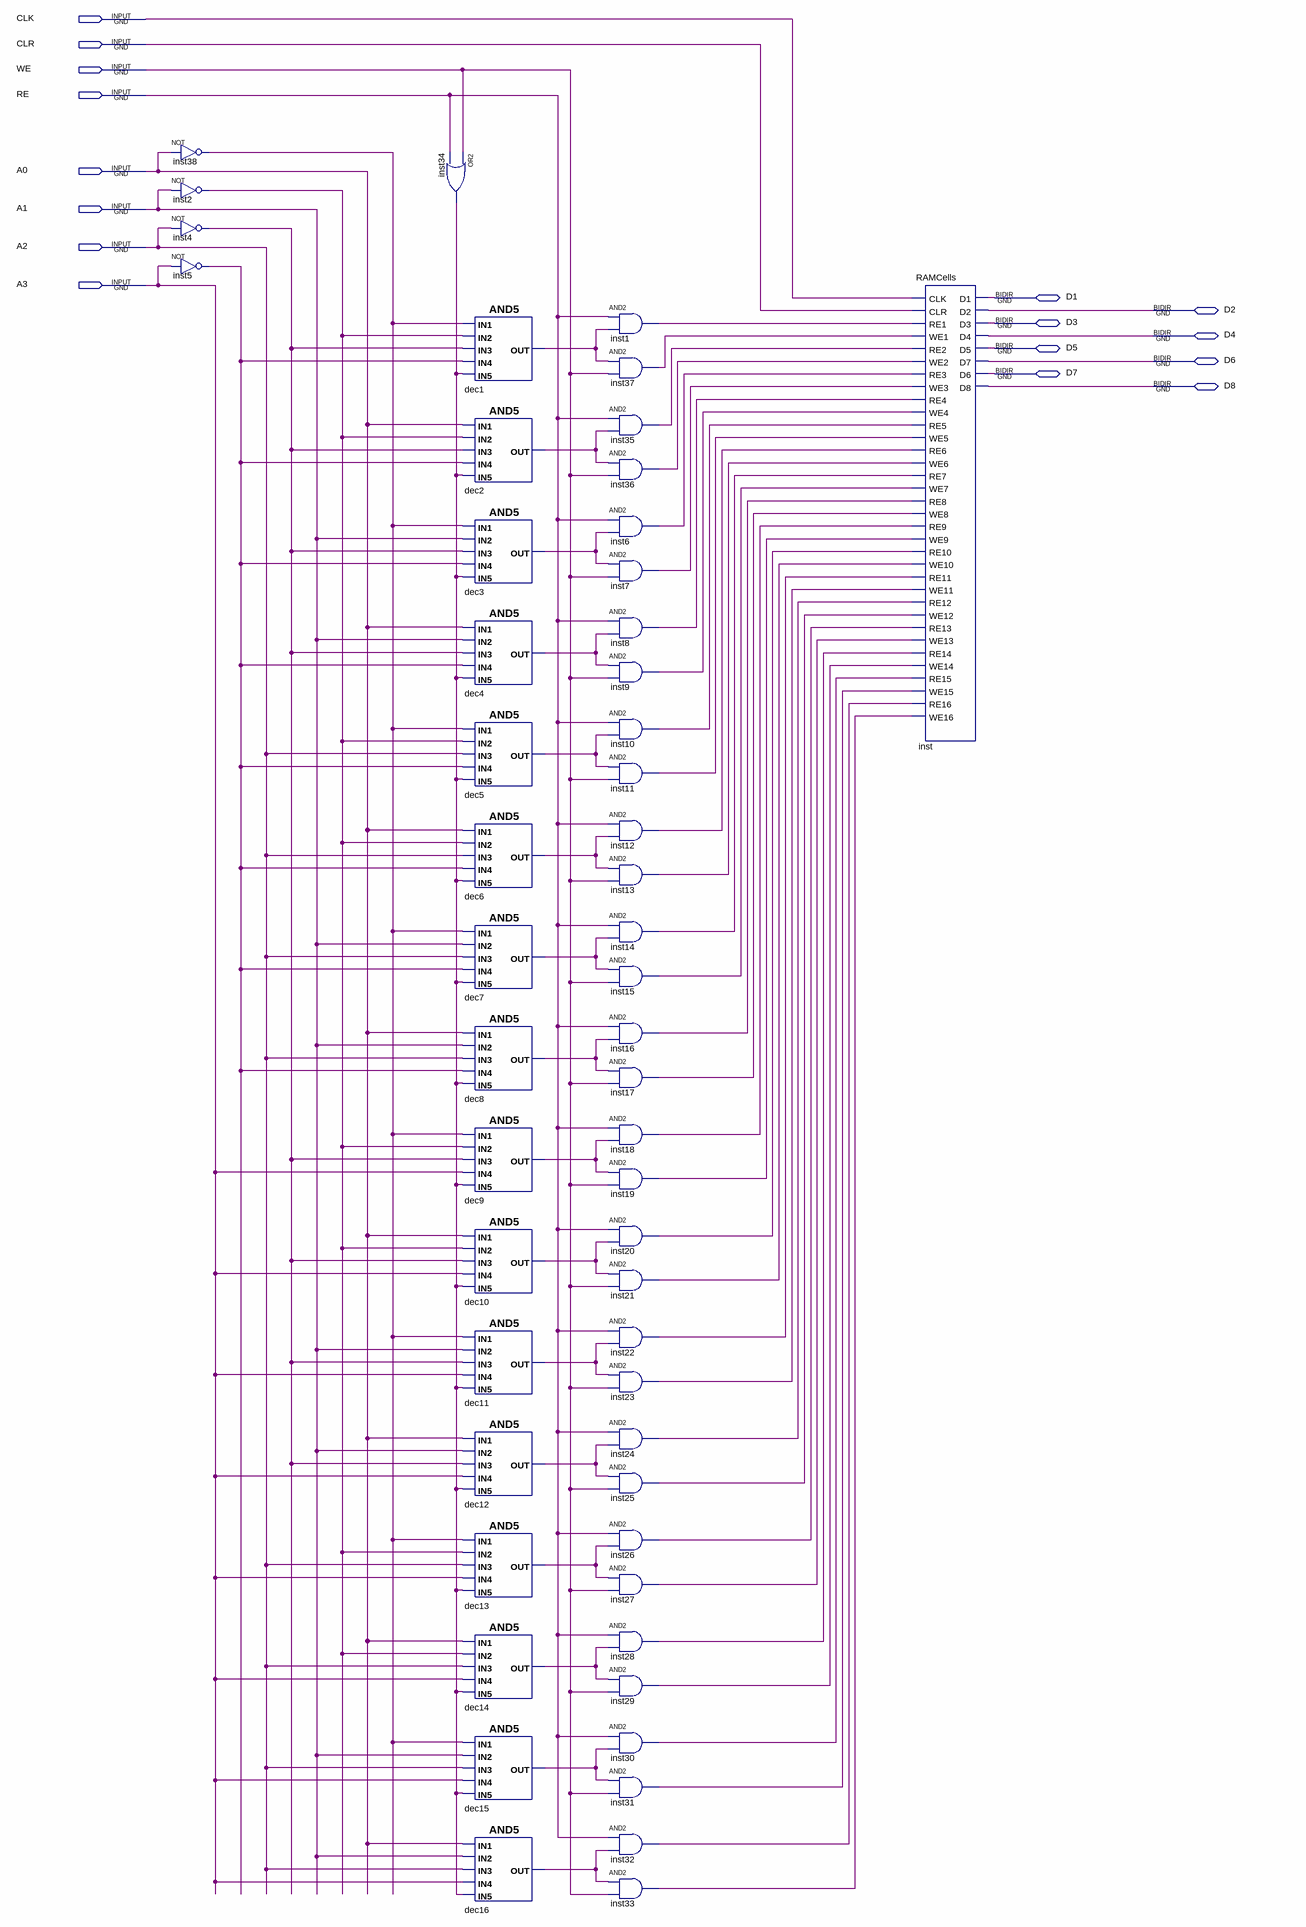
[diagram p0: schematic sheet]
// Quartus schematic RAM.bdf as structural Verilog: 54 symbols, 16 pins
module RAM (
  input  CLK,
  input  CLR,
  input  WE,
  input  RE,
  input  A0,
  input  A1,
  input  A2,
  input  A3,
  inout  D1,
  inout  D2,
  inout  D3,
  inout  D4,
  inout  D5,
  inout  D6,
  inout  D7,
  inout  D8
);

  wire dec1_out, dec2_out, dec3_out, dec4_out, dec5_out, dec6_out, dec7_out, dec8_out, dec9_out, dec10_out,
       dec11_out, dec12_out, dec13_out, dec14_out, dec15_out, dec16_out, inst1_out, inst2_out, inst4_out,
       inst5_out, inst6_out, inst7_out, inst8_out, inst9_out, inst10_out, inst11_out, inst12_out, inst13_out,
       inst14_out, inst15_out, inst16_out, inst17_out, inst18_out, inst19_out, inst20_out, inst21_out,
       inst22_out, inst23_out, inst24_out, inst25_out, inst26_out, inst27_out, inst28_out, inst29_out,
       inst30_out, inst31_out, inst32_out, inst33_out, inst34_out, inst35_out, inst36_out, inst37_out,
       inst38_out;

  not inst38 (inst38_out, A0);
  not inst2 (inst2_out, A1);
  not inst4 (inst4_out, A2);
  not inst5 (inst5_out, A3);
  or inst34 (inst34_out, WE, RE);
  and dec1 (dec1_out, inst38_out, inst2_out, inst4_out, inst5_out, inst34_out);
  and dec2 (dec2_out, A0, inst2_out, inst4_out, inst5_out, inst34_out);
  and dec3 (dec3_out, inst38_out, A1, inst4_out, inst5_out, inst34_out);
  and dec4 (dec4_out, A0, A1, inst4_out, inst5_out, inst34_out);
  and dec5 (dec5_out, inst38_out, inst2_out, A2, inst5_out, inst34_out);
  and dec6 (dec6_out, A0, inst2_out, A2, inst5_out, inst34_out);
  and dec7 (dec7_out, inst38_out, A1, A2, inst5_out, inst34_out);
  and dec8 (dec8_out, A0, A1, A2, inst5_out, inst34_out);
  and dec9 (dec9_out, inst38_out, inst2_out, inst4_out, A3, inst34_out);
  and dec10 (dec10_out, A0, inst2_out, inst4_out, A3, inst34_out);
  and dec11 (dec11_out, inst38_out, A1, inst4_out, A3, inst34_out);
  and dec12 (dec12_out, A0, A1, inst4_out, A3, inst34_out);
  and dec13 (dec13_out, inst38_out, inst2_out, A2, A3, inst34_out);
  and dec14 (dec14_out, A0, inst2_out, A2, A3, inst34_out);
  and dec15 (dec15_out, inst38_out, A1, A2, A3, inst34_out);
  and dec16 (dec16_out, A0, A1, A2, A3, inst34_out);
  and inst1 (inst1_out, RE, dec1_out);
  and inst37 (inst37_out, dec1_out, WE);
  and inst35 (inst35_out, RE, dec2_out);
  and inst36 (inst36_out, dec2_out, WE);
  and inst6 (inst6_out, RE, dec3_out);
  and inst7 (inst7_out, dec3_out, WE);
  and inst8 (inst8_out, RE, dec4_out);
  and inst9 (inst9_out, dec4_out, WE);
  and inst10 (inst10_out, RE, dec5_out);
  and inst11 (inst11_out, dec5_out, WE);
  and inst12 (inst12_out, RE, dec6_out);
  and inst13 (inst13_out, dec6_out, WE);
  and inst14 (inst14_out, RE, dec7_out);
  and inst15 (inst15_out, dec7_out, WE);
  and inst16 (inst16_out, RE, dec8_out);
  and inst17 (inst17_out, dec8_out, WE);
  and inst18 (inst18_out, RE, dec9_out);
  and inst19 (inst19_out, dec9_out, WE);
  and inst20 (inst20_out, RE, dec10_out);
  and inst21 (inst21_out, dec10_out, WE);
  and inst22 (inst22_out, RE, dec11_out);
  and inst23 (inst23_out, dec11_out, WE);
  and inst24 (inst24_out, RE, dec12_out);
  and inst25 (inst25_out, dec12_out, WE);
  and inst26 (inst26_out, RE, dec13_out);
  and inst27 (inst27_out, dec13_out, WE);
  and inst28 (inst28_out, RE, dec14_out);
  and inst29 (inst29_out, dec14_out, WE);
  and inst30 (inst30_out, RE, dec15_out);
  and inst31 (inst31_out, dec15_out, WE);
  and inst32 (inst32_out, RE, dec16_out);
  and inst33 (inst33_out, dec16_out, WE);
  RAMCells inst (
    .CLK(CLK), .CLR(CLR), .RE1(inst1_out), .WE1(inst37_out), .RE2(inst35_out), .WE2(inst36_out),
    .RE3(inst6_out), .WE3(inst7_out), .RE4(inst8_out), .WE4(inst9_out), .RE5(inst10_out), .WE5(inst11_out),
    .RE6(inst12_out), .WE6(inst13_out), .RE7(inst14_out), .WE7(inst15_out), .RE8(inst16_out),
    .WE8(inst17_out), .RE9(inst18_out), .WE9(inst19_out), .RE10(inst20_out), .WE10(inst21_out),
    .RE11(inst22_out), .WE11(inst23_out), .RE12(inst24_out), .WE12(inst25_out), .RE13(inst26_out),
    .WE13(inst27_out), .RE14(inst28_out), .WE14(inst29_out), .RE15(inst30_out), .WE15(inst31_out),
    .RE16(inst32_out), .WE16(inst33_out), .D1(D1), .D2(D2), .D3(D3), .D4(D4), .D5(D5), .D7(D6), .D6(D7),
    .D8(D8));
endmodule
